# Altium schematic sheet esd_project.SchDoc
size A3
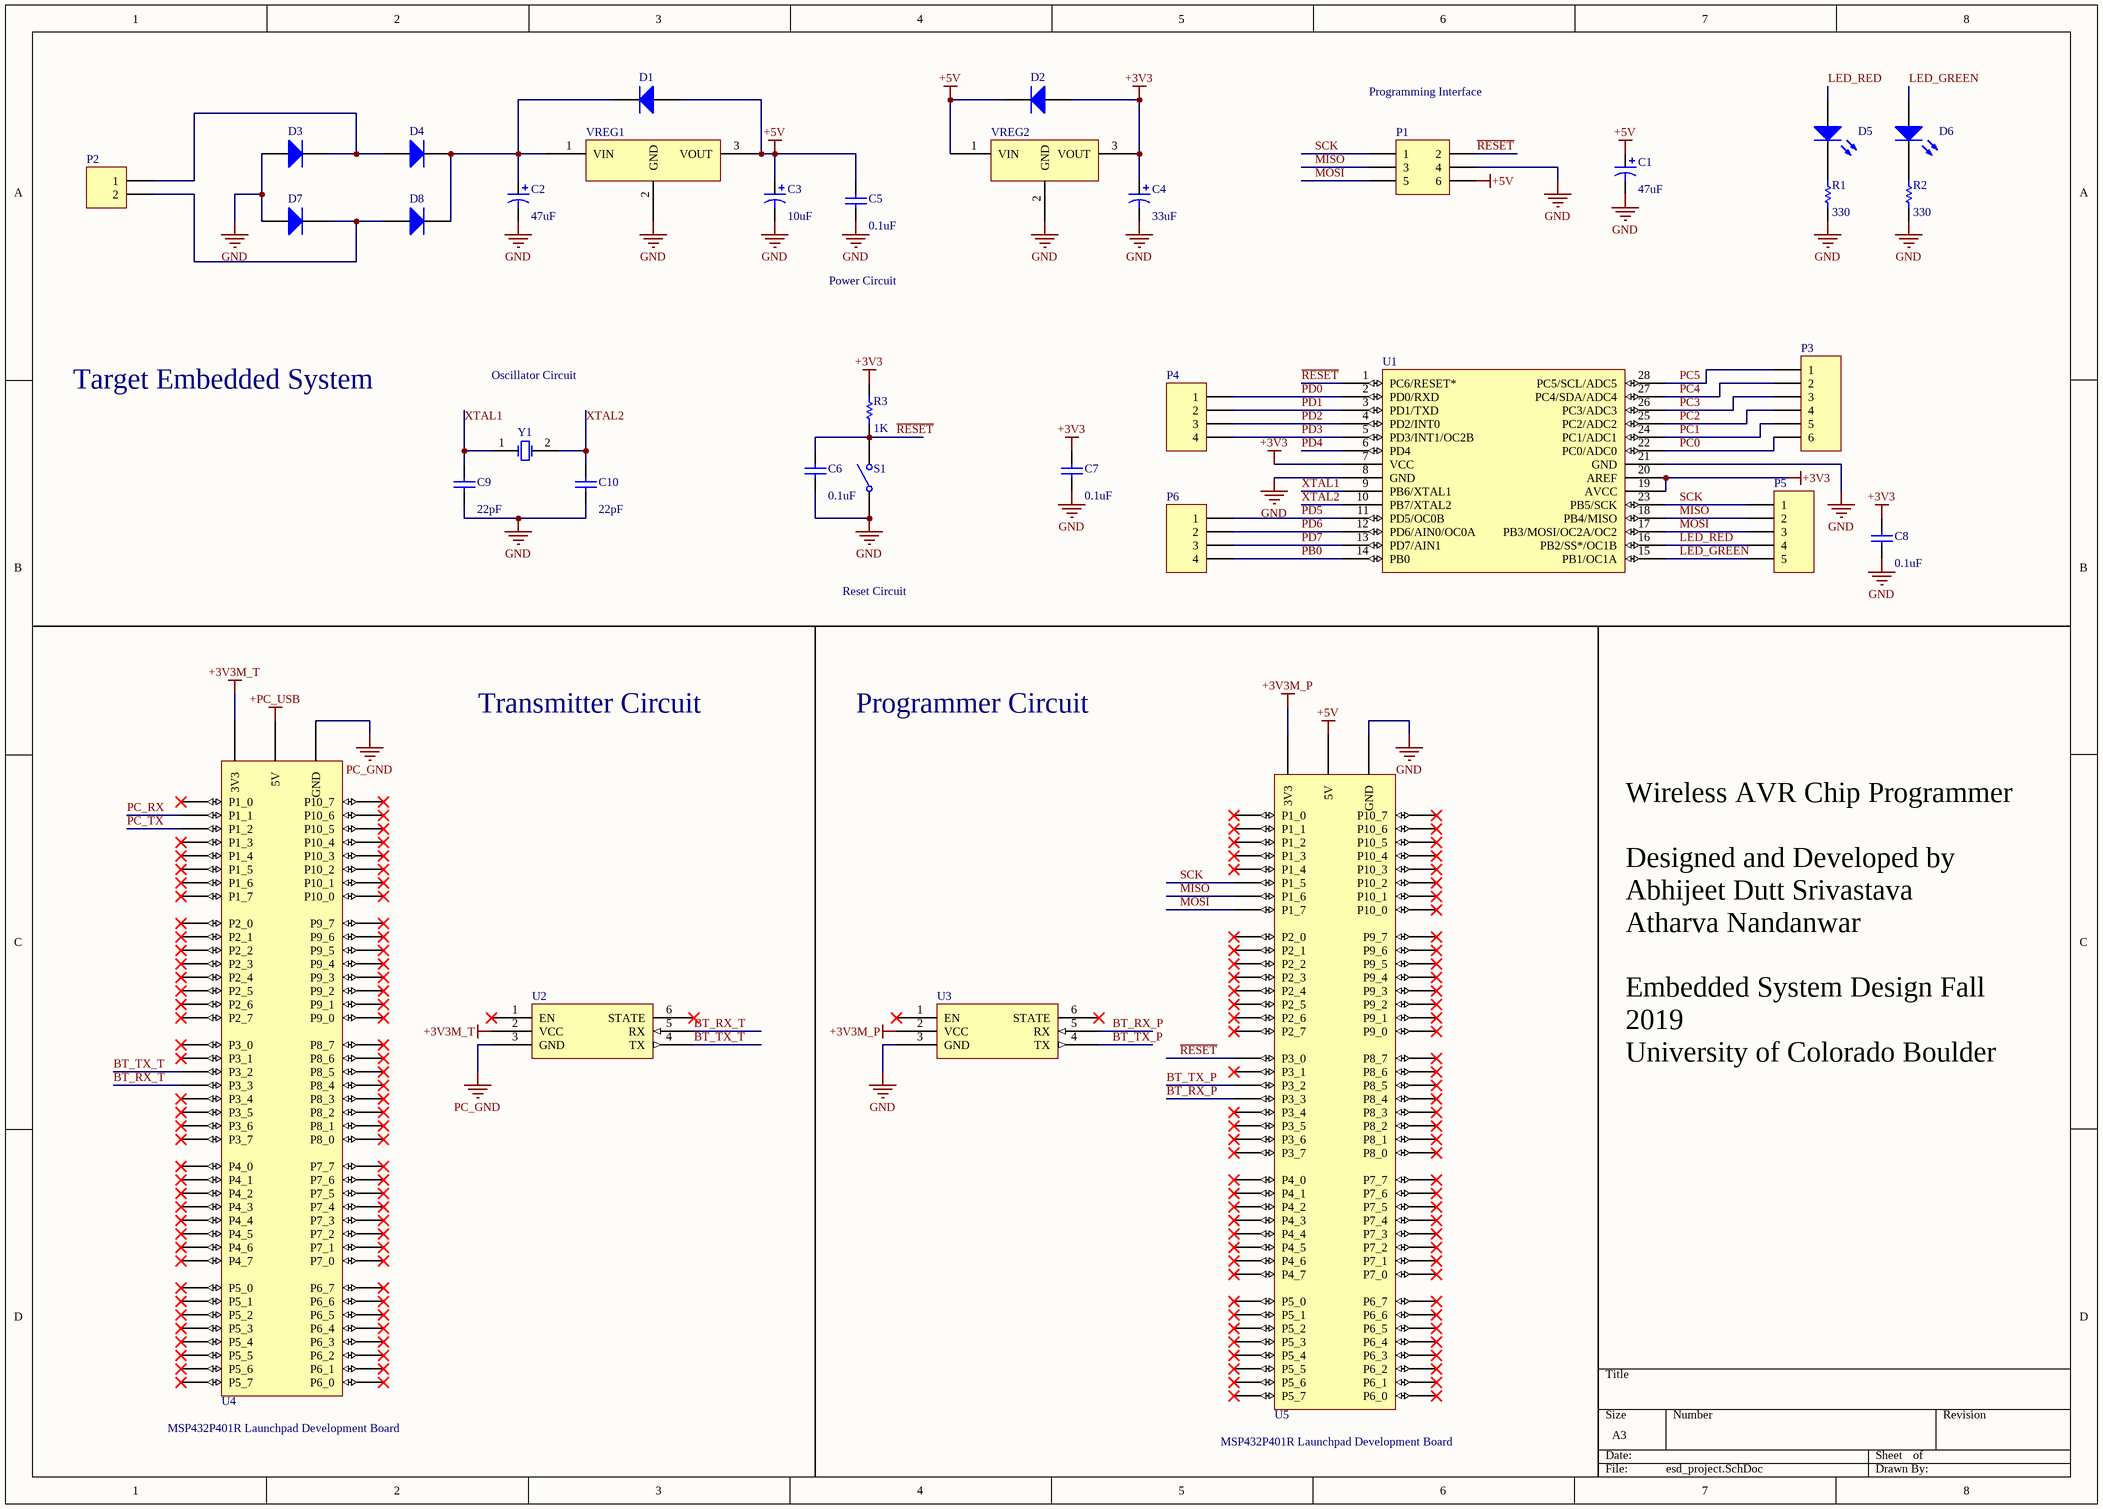
[diagram p0: esd_project.SchDoc]

## Parts
C1  value 47uF  [RB7.6-15]  (hidden comment: Cap Pol1)
C2  value 47uF  [RB7.6-15]  (hidden comment: Cap Pol1)
C3  value 10uF  [RB7.6-15]  (hidden comment: Cap Pol1)
C4  value 33uF  [RB7.6-15]  (hidden comment: Cap Pol1)
C5  value 0.1uF  [RAD-0.3]  (hidden comment: Cap)
C6  value 0.1uF  [RAD-0.3]  (hidden comment: Cap)
C7  value 0.1uF  [RAD-0.3]  (hidden comment: Cap)
C8  value 0.1uF  [RAD-0.3]  (hidden comment: Cap)
C9  value 22pF  [RAD-0.3]  (hidden comment: Cap)
C10  value 22pF  [RAD-0.3]  (hidden comment: Cap)
D1  Diode 1N4003  [DO-41]  (value not drawn)
D2  Diode 1N4003  [DO-41]  (value not drawn)
D3  Diode 1N4003  [DO-41]  (value not drawn)
D4  Diode 1N4003  [DO-41]  (value not drawn)
D5  LED0  [LED-0]  (value not drawn)
D6  LED0  [LED-0]  (value not drawn)
D7  Diode 1N4003  [DO-41]  (value not drawn)
D8  Diode 1N4003  [DO-41]  (value not drawn)
P1  Header 3X2  [HDR2X3]  (value not drawn)
P2  MHDR1X2  [MHDR1X2]  (value not drawn)
P3  Header 6  [HDR1X6]  (value not drawn)
P4  Header 4  [HDR1X4]  (value not drawn)
P5  Header 5  [HDR1X5]  (value not drawn)
P6  Header 4  [HDR1X4]  (value not drawn)
R1  value 330  [AXIAL-0.3]  (hidden comment: Res1)
R2  value 330  [AXIAL-0.3]  (hidden comment: Res1)
R3  value 1K  [AXIAL-0.3]  (hidden comment: Res1)
S1  SW-SPST  [SPST-2]  (value not drawn)
U1  ATmega328P-PU  [PDIP-28]  (value not drawn)
U2  HC-05  (value not drawn)
U3  HC-05  (value not drawn)
U4  MSP432P401R  (value not drawn)
U5  MSP432P401R  (value not drawn)
VREG1  7805  [TO-220]  (value not drawn)
VREG2  MCP1857  [SOT-223]  (value not drawn)
Y1  8MHz  [R38]  (value not drawn)

## Nets
+3V3: C4.1 C7.2 C8.2 D2.1(A) R3.2 U1.7(VCC) U1.19(AVCC) U1.20(AREF) VREG2.3(VOUT)
+3V3M_P: U3.2(VCC) U5.1(3V3)
+3V3M_T: U2.2(VCC) U4.1(3V3)
+5V: C1.1 C3.1 C5.1 D1.1(A) D2.2(K) P1.6 U5.82(5V) VREG1.3(VOUT) VREG2.1(VIN)
+PC_USB: U4.82(5V)
GND: C1.2 C2.2 C3.2 C4.2 C5.2 C6.1 C7.1 C8.1 C9.1 C10.1 D3.1(A) D7.1(A) P1.4 R1.1 R2.1 S1.1(COMMON) U1.8(GND) U1.21(GND) U3.3(GND) U5.83(GND) VREG1.2(GND) VREG2.2(GND)
PC_GND: U2.3(GND) U4.83(GND)
BT_RX_P: U3.5(RX) U5.21(P3_3)
BT_RX_T: U2.5(RX) U4.21(P3_3)
BT_TX_P: U3.4(TX) U5.20(P3_2)
BT_TX_T: U2.4(TX) U4.20(P3_2)
LED_GREEN: D6.1(A) P5.5 U1.15(PB1/OC1A)
LED_RED: D5.1(A) P5.4 U1.16(PB2/SS*/OC1B)
MISO: P1.3 P5.2 U1.18(PB4/MISO) U5.8(P1_6)
MOSI: P1.5 P5.3 U1.17(PB3/MOSI/OC2A/OC2) U5.9(P1_7)
PB0: P6.4 U1.14(PB0)
PC0: P3.6 U1.22(PC0/ADC0)
PC1: P3.5 U1.24(PC1/ADC1)
PC2: P3.4 U1.25(PC2/ADC2)
PC3: P3.3 U1.26(PC3/ADC3)
PC4: P3.2 U1.27(PC4/SDA/ADC4)
PC5: P3.1 U1.28(PC5/SCL/ADC5)
PC_RX: U4.3(P1_1)
PC_TX: U4.4(P1_2)
PD0: P4.1 U1.2(PD0/RXD)
PD1: P4.2 U1.3(PD1/TXD)
PD2: P4.3 U1.4(PD2/INT0)
PD3: P4.4 U1.5(PD3/INT1/OC2B)
PD4: U1.6(PD4)
PD5: P6.1 U1.11(PD5/OC0B)
PD6: P6.2 U1.12(PD6/AIN0/OC0A)
PD7: P6.3 U1.13(PD7/AIN1)
~{RESET}: C6.2 P1.2 R3.1 S1.2(NO) U1.1(PC6/RESET*) U5.18(P3_0)
SCK: P1.1 P5.1 U1.23(PB5/SCK) U5.7(P1_5)
XTAL1: C9.2 U1.9(PB6/XTAL1) Y1.1(OSC1)
XTAL2: C10.2 U1.10(PB7/XTAL2) Y1.2(OSC2)
NetC2_1: C2.1 D1.2(K) D4.2(K) D8.2(K) VREG1.1(VIN)
NetD3_2: D3.2(K) D4.1(A) P2.1
NetD5_2: D5.2(K) R1.2
NetD6_2: D6.2(K) R2.2
NetD7_2: D7.2(K) D8.1(A) P2.2

Not connected (* = marked no-connect by the designer): U2 1(EN)* 6(STATE)*; U3 1(EN)* 6(STATE)*; U4 2(P1_0)* 5(P1_3)* 6(P1_4)* 7(P1_5)* 8(P1_6)* 9(P1_7)* 10(P2_0)* 11(P2_1)* 12(P2_2)* 13(P2_3)* 14(P2_4)* 15(P2_5)* 16(P2_6)* 17(P2_7)* 18(P3_0)* 19(P3_1)* 22(P3_4)* 23(P3_5)* 24(P3_6)* 25(P3_7)* 26(P4_0)* 27(P4_1)* 28(P4_2)* 29(P4_3)* 30(P4_4)* 31(P4_5)* 32(P4_6)* 33(P4_7)* 34(P5_0)* 35(P5_1)* 36(P5_2)* 37(P5_3)* 38(P5_4)* 39(P5_5)* 40(P5_6)* 41(P5_7)* 42(P6_0)* 43(P6_1)* 44(P6_2)* 45(P6_3)* 46(P6_4)* 47(P6_5)* 48(P6_6)* 49(P6_7)* 50(P7_0)* 51(P7_1)* 52(P7_2)* 53(P7_3)* 54(P7_4)* 55(P7_5)* 56(P7_6)* 57(P7_7)* 58(P8_0)* 59(P8_1)* 60(P8_2)* 61(P8_3)* 62(P8_4)* 63(P8_5)* 64(P8_6)* 65(P8_7)* 66(P9_0)* 67(P9_1)* 68(P9_2)* 69(P9_3)* 70(P9_4)* 71(P9_5)* 72(P9_6)* 73(P9_7)* 74(P10_0)* 75(P10_1)* 76(P10_2)* 77(P10_3)* 78(P10_4)* 79(P10_5)* 80(P10_6)* 81(P10_7)*; U5 2(P1_0)* 3(P1_1)* 4(P1_2)* 5(P1_3)* 6(P1_4)* 10(P2_0)* 11(P2_1)* 12(P2_2)* 13(P2_3)* 14(P2_4)* 15(P2_5)* 16(P2_6)* 17(P2_7)* 19(P3_1)* 22(P3_4)* 23(P3_5)* 24(P3_6)* 25(P3_7)* 26(P4_0)* 27(P4_1)* 28(P4_2)* 29(P4_3)* 30(P4_4)* 31(P4_5)* 32(P4_6)* 33(P4_7)* 34(P5_0)* 35(P5_1)* 36(P5_2)* 37(P5_3)* 38(P5_4)* 39(P5_5)* 40(P5_6)* 41(P5_7)* 42(P6_0)* 43(P6_1)* 44(P6_2)* 45(P6_3)* 46(P6_4)* 47(P6_5)* 48(P6_6)* 49(P6_7)* 50(P7_0)* 51(P7_1)* 52(P7_2)* 53(P7_3)* 54(P7_4)* 55(P7_5)* 56(P7_6)* 57(P7_7)* 58(P8_0)* 59(P8_1)* 60(P8_2)* 61(P8_3)* 62(P8_4)* 63(P8_5)* 64(P8_6)* 65(P8_7)* 66(P9_0)* 67(P9_1)* 68(P9_2)* 69(P9_3)* 70(P9_4)* 71(P9_5)* 72(P9_6)* 73(P9_7)* 74(P10_0)* 75(P10_1)* 76(P10_2)* 77(P10_3)* 78(P10_4)* 79(P10_5)* 80(P10_6)* 81(P10_7)*

## Notes on the sheet
- Programming Interface
- Power Circuit
- Oscillator Circuit
- Target Embedded System
- Reset Circuit
- Transmitter Circuit
- Programmer Circuit
- Wireless AVR Chip Programmer
  Designed and Developed by
  Abhijeet Dutt Srivastava
  Atharva Nandanwar
  Embedded System Design Fall 2019
  University of Colorado Boulder
- (near U4) MSP432P401R Launchpad Development Board
- (near U5) MSP432P401R Launchpad Development Board

## Library data of the parts
C1-C4 = Cap Pol1: Polarized Capacitor (Radial); Published: 8-Jun-2000; LatestRevisionDate: 17-Jul-2002; LatestRevisionNote: Re-released for DXP Platform.; PackageReference: RB7.6-15; Publisher: Altium Limited; PackageDescription: Polarized Capacitor (Radial); 2 Leads
C5-C10 = Cap: Capacitor; Published: 8-Jun-2000; LatestRevisionDate: 17-Jul-2002; LatestRevisionNote: Re-released for DXP Platform.; PackageReference: RAD-0.3; Publisher: Altium Limited; PackageDescription: Radial Cap, Thru-Hole; 2 Leads; 0.3 in Pin Spacing
D1-D4 D7 D8 = Diode 1N4003: 1 Amp General Purpose Rectifier; Published: 8-Jun-2000; LatestRevisionDate: 17-Jul-2002; LatestRevisionNote: Re-released for DXP Platform.; DatasheetVersion: 1998; PackageVersion: Aug-1999; PackageReference: DO-41; Publisher: Altium Limited; PackageDescription: Diode, Axial; Body 5.2 x 2.7 mm (LxDia. max), Lead Dia. 0.86 mm (max); Code_JEDEC: DO-204-AL; ComponentLink1Description: Manufacturer Link; ComponentLink1URL: http://www.fairchildsemi.com/; ComponentLink2Description: Datasheet; ComponentLink2URL: http://www.fairchildsemi.com/ds/1N%2F1N4001.pdf
D5 D6 = LED0: Typical INFRARED GaAs LED; Published: 8-Jun-2000; LatestRevisionDate: 08-Jul-2005; LatestRevisionNote: Mech Layer 1 removed.; PackageReference: LED-0; Publisher: Altium Limited; PackageDescription: LED; 2 Leads
P1 = Header 3X2: Header, 3-Pin, Dual row; LatestRevisionDate: 17-Jul-2002; LatestRevisionNote: Re-released for DXP Platform.; Publisher: Altium Limited
P2 = MHDR1X2: Header, 2-Pin; LatestRevisionDate: 17-Jul-2002; LatestRevisionNote: Re-released for DXP Platform.; Publisher: Altium Limited
P3 = Header 6: Header, 6-Pin; LatestRevisionDate: 17-Jul-2002; LatestRevisionNote: Re-released for DXP Platform.; Publisher: Altium Limited
P4 P6 = Header 4: Header, 4-Pin; LatestRevisionDate: 17-Jul-2002; LatestRevisionNote: Re-released for DXP Platform.; Publisher: Altium Limited
P5 = Header 5: Header, 5-Pin; LatestRevisionDate: 17-Jul-2002; LatestRevisionNote: Re-released for DXP Platform.; Publisher: Altium Limited
R1-R3 = Res1: Resistor; Published: 8-Jun-2000; LatestRevisionDate: 17-Jul-2002; LatestRevisionNote: Re-released for DXP Platform.; PackageReference: AXIAL-0.3; Publisher: Altium Limited; PackageDescription: Axial Device, Thru-Hole; 2 Leads; 0.3 in Pin Spacing
S1 = SW-SPST: Single-Pole, Single-Throw Switch; Published: 24-Mar-1999; LatestRevisionDate: 17-Jul-2002; LatestRevisionNote: Re-released for DXP Platform.; PackageReference: SPST-2; Publisher: Altium Limited; PackageDescription: Switch; 2 Leads
VREG2 = AZ1117
Y1 = XTAL: Crystal Oscillator; Published: 8-Jun-2000; LatestRevisionDate: 17-Jul-2002; LatestRevisionNote: Re-released for DXP Platform.; PackageReference: R38; Publisher: Altium Limited; PackageDescription: Crystal, Thru-Hole; 2 Leads; Body 3.1 x 8.2 mm (Dia.xH)